# Altium schematic sheet Sheet1.SchDoc
size A4
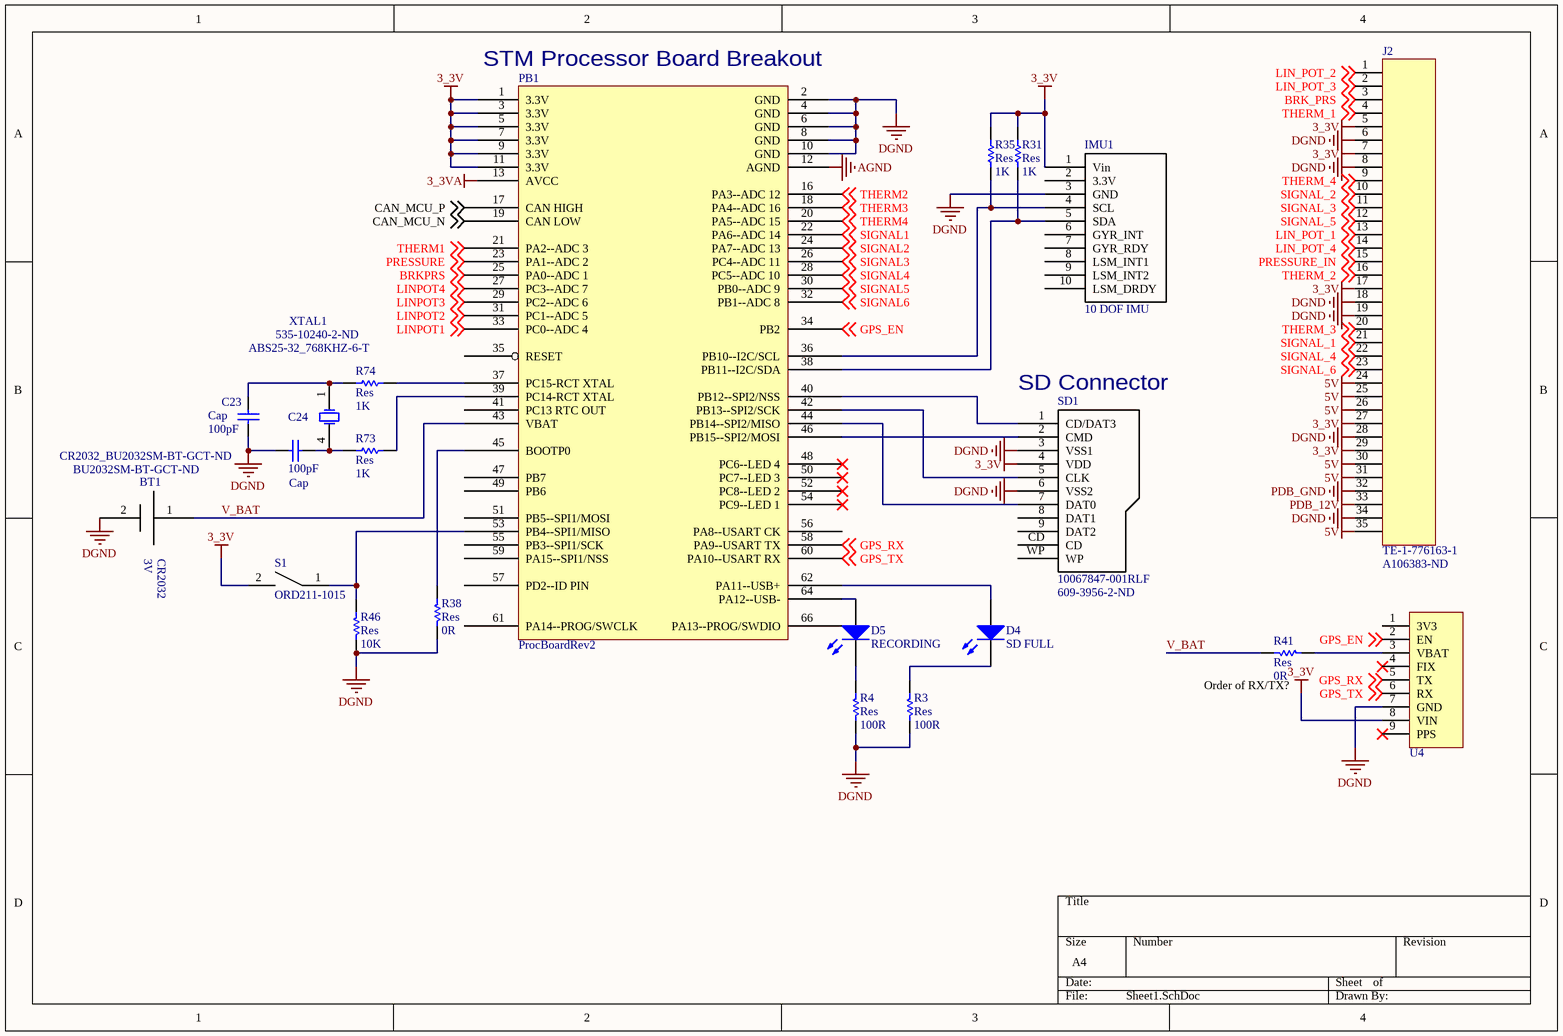
[diagram p0: Sheet1.SchDoc]

## Parts
BT1  CR2032_BU2032SM-BT-GCT-ND  [BU2032SM-BT-GCT-ND]
C23  Cap  value 100pF  [C0805]
C24  Cap  value 100pF  [C0805]
D4  SD FULL  [OVS5MABCR4]
D5  RECORDING  [OVS5MGBCR4]
IMU1  10 DOF IMU  [Adafruit_10DOF_IMU]
J2  TE-1-776163-1  Supplier Part Number 1: A106383-ND  [TE-1-776163-1]
PB1  ProcBoardRev2  [PROC_BOARD]
R3  Res  value 100R  [3216[1206]]
R4  Res  value 100R  [3216[1206]]
R31  Res  value 1K  [2012[0805]]
R35  Res  value 1K  [2012[0805]]
R38  Res  value 0R  [3216[1206]]  (no BOM)
R41  Res  value 0R  [3216[1206]]  (no BOM)
R46  Res  value 10K  [3216[1206]]
R73  Res  value 1K  [2012[0805]]
R74  Res  value 1K  [2012[0805]]
S1  ORD211-1015  [ORD211-1015]
SD1  10067847-001RLF  Supplier Part Number 1: 609-3956-2-ND  [10067847-001RLF]
U4  MTK3339 MODULE  [MTK3339 MODULE]  (value not drawn)
XTAL1  ABS25-32_768KHZ-6-T  Supplier Part Number 1: 535-10240-2-ND  [ABS25-32_768KHZ-6-T]

## Nets
3_3V: IMU1.1(Vin) J2.5 J2.7 J2.17 J2.27 J2.29 PB1.1(3.3V) PB1.3(3.3V) PB1.5(3.3V) PB1.7(3.3V) PB1.9(3.3V) PB1.11(3.3V) R31.1 R35.1 S1.2 SD1.4(VDD) U4.8(VIN)
3_3VA: PB1.13(AVCC)
5V: J2.24 J2.25 J2.26 J2.30 J2.31 J2.35
AGND: PB1.12(AGND)
DGND: BT1.2 C23.1 C24.2 IMU1.3(GND) J2.6 J2.8 J2.18 J2.19 J2.28 J2.34 PB1.2(GND) PB1.4(GND) PB1.6(GND) PB1.8(GND) PB1.10(GND) R3.1 R4.1 R38.1 R46.1 SD1.3(VSS1) SD1.6(VSS2) U4.7(GND)
PDB_12V: J2.33
PDB_GND: J2.32
BRK_PRS: J2.3 ; off-sheet BRK_PRS
BRKPRS: PB1.25(PA0--ADC_1) ; off-sheet BRKPRS
CAN_MCU_N: PB1.19(CAN_LOW) ; off-sheet CAN_MCU_N
CAN_MCU_P: PB1.17(CAN_HIGH) ; off-sheet CAN_MCU_P
GPS_EN: PB1.34(PB2) U4.2(EN) ; off-sheet GPS_EN
GPS_RX: PB1.58(PA9--USART_TX) U4.5(TX) ; off-sheet GPS_RX
GPS_TX: PB1.60(PA10--USART_RX) U4.6(RX) ; off-sheet GPS_TX
LIN_POT_1: J2.13 ; off-sheet LIN_POT_1
LIN_POT_2: J2.1 ; off-sheet LIN_POT_2
LIN_POT_3: J2.2 ; off-sheet LIN_POT_3
LIN_POT_4: J2.14 ; off-sheet LIN_POT_4
LINPOT1: PB1.33(PC0--ADC_4) ; off-sheet LINPOT1
LINPOT2: PB1.31(PC1--ADC_5) ; off-sheet LINPOT2
LINPOT3: PB1.29(PC2--ADC_6) ; off-sheet LINPOT3
LINPOT4: PB1.27(PC3--ADC_7) ; off-sheet LINPOT4
PRESSURE: PB1.23(PA1--ADC_2) ; off-sheet PRESSURE
PRESSURE_IN: J2.15 ; off-sheet PRESSURE_IN
SIGNAL1: PB1.22(PA6--ADC_14) ; off-sheet SIGNAL1
SIGNAL2: PB1.24(PA7--ADC_13) ; off-sheet SIGNAL2
SIGNAL3: PB1.26(PC4--ADC_11) ; off-sheet SIGNAL3
SIGNAL4: PB1.28(PC5--ADC_10) ; off-sheet SIGNAL4
SIGNAL5: PB1.30(PB0--ADC_9) ; off-sheet SIGNAL5
SIGNAL6: PB1.32(PB1--ADC_8) ; off-sheet SIGNAL6
SIGNAL_1: J2.21 ; off-sheet SIGNAL_1
SIGNAL_2: J2.10 ; off-sheet SIGNAL_2
SIGNAL_3: J2.11 ; off-sheet SIGNAL_3
SIGNAL_4: J2.22 ; off-sheet SIGNAL_4
SIGNAL_5: J2.12 ; off-sheet SIGNAL_5
SIGNAL_6: J2.23 ; off-sheet SIGNAL_6
THERM1: PB1.21(PA2--ADC_3) ; off-sheet THERM1
THERM2: PB1.16(PA3--ADC_12) ; off-sheet THERM2
THERM3: PB1.18(PA4--ADC_16) ; off-sheet THERM3
THERM4: PB1.20(PA5--ADC_15) ; off-sheet THERM4
THERM_1: J2.4 ; off-sheet THERM_1
THERM_2: J2.16 ; off-sheet THERM_2
THERM_3: J2.20 ; off-sheet THERM_3
THERM_4: J2.9 ; off-sheet THERM_4
V_BAT: BT1.1 PB1.43(VBAT) R41.2
NetC23_2: C23.2 R74.2 XTAL1.1(OSC1)
NetC24_1: C24.1 R73.2 XTAL1.4(OSC4)
NetD4_1: D4.1(A) PB1.62(PA11--USB+)
NetD4_2: D4.2(K) R3.2
NetD5_1: D5.1(A) PB1.64(PA12--USB-)
NetD5_2: D5.2(K) R4.2
NetIMU1_4: IMU1.4(SCL) PB1.36(PB10--I2C/SCL) R35.2
NetIMU1_5: IMU1.5(SDA) PB1.38(PB11--I2C/SDA) R31.2
NetPB1_37: PB1.37(PC15-RCT_XTAL) R74.1
NetPB1_39: PB1.39(PC14-RCT_XTAL) R73.1
NetPB1_40: PB1.40(PB12--SPI2/NSS) SD1.1(CD/DAT3)
NetPB1_42: PB1.42(PB13--SPI2/SCK) SD1.5(CLK)
NetPB1_44: PB1.44(PB14--SPI2/MISO) SD1.7(DAT0)
NetPB1_45: PB1.45(BOOTP0) R38.2
NetPB1_46: PB1.46(PB15--SPI2/MOSI) SD1.2(CMD)
NetPB1_53: PB1.53(PB4--SPI1/MISO) R46.2 S1.1
NetR41_1: R41.1 U4.3(VBAT)

Not connected (* = marked no-connect by the designer): IMU1 2(3.3V) 6(GYR_INT) 7(GYR_RDY) 8(LSM_INT1) 9(LSM_INT2) 10(LSM_DRDY); PB1 14(NC) 15(NC) 35(RESET) 41(PC13_RTC_OUT) 47(PB7) 48(PC6--LED_4)* 49(PB6) 50(PC7--LED_3)* 51(PB5--SPI1/MOSI) 52(PC8--LED_2)* 54(PC9--LED_1)* 55(PB3--SPI1/SCK) 56(PA8--USART_CK) 57(PD2--ID_PIN) 59(PA15--SPI1/NSS) 61(PA14--PROG/SWCLK) 63(NC) 65(NC) 66(PA13--PROG/SWDIO) 67; SD1 8(DAT1) 9(DAT2) CD WP; U4 1(3V3) 4(FIX)* 9(PPS)*

## Notes on the sheet
- (near PB1) STM Processor Board Breakout
- (near SD1) SD Connector
- (near R41) Order of RX/TX?
- (in symbol CR2032_BU2032SM-BT-GCT-ND) 3V; CR2032

## Library data of the parts
BT1 = CR2032_BU2032SM-BT-GCT-ND: Coin Cell Battery Holder_BU2032SM-BT-GCT-ND; Supplier: Digikey; Supplier 1: Digi-Key; Supplier Part Number 1: BU2032SM-BT-GCT-ND; Supplier Pt Number: BU2032SM-BT-GCT-ND
C23 C24 = Cap: Capacitor; Published: 8-Jun-2000; LatestRevisionDate: 17-Jul-2002; LatestRevisionNote: Re-released for DXP Platform.; PackageReference: C1206; Publisher: Altium Limited
D4 = OVS5MABCR4: Typical AMBER LED; Published: 8-Jun-2000; LatestRevisionDate: 17-Jul-2002; LatestRevisionNote: Re-released for DXP Platform.; PackageDocument: Feb-2002; PackageReference: 3.2X1.6X1.1; Publisher: Altium Limited; Supplier 1: Digi-Key; Colour: AMBER; Supplier Part Number 1: 365-1543-1-ND
D5 = OVS5MGBCR4: Typical GREEN LED; Published: 8-Jun-2000; LatestRevisionDate: 17-Jul-2002; LatestRevisionNote: Re-released for DXP Platform.; PackageDocument: Feb-2002; PackageReference: 3.2X1.6X1.1; Publisher: Altium Limited; Supplier 1: Digi-Key; Colour: GREEN; Supplier Part Number 1: 365-1545-1-ND
IMU1 = Adafruit_10DOF_IMU
J2 = TE-1-776163-1: CONN HEADER 35POS R/A GOLD BLACK; Supplier 1: Digi-Key
PB1 = ProcBoardRev2: Processor board that carries the STM32F072RB
R3 R4 R31 R35 R38 R41 R46 R73 R74 = Res: Surface Mount Resistor; Published: 8-Jun-2000; LatestRevisionDate: 17-Jul-2002; LatestRevisionNote: Re-released for DXP Platform.; PackageReference: AXIAL-0.5; Publisher: Altium Limited
S1 = ORD211-1015: REED Switch; Manufacturer: Standex-Meder Electronics; Circuit: SPST-NO; Operate Range: 10 ~ 15AT; Current - Switching: 100mA (AC/DC); Voltage - Switching AC: 24V; Power - Rated: 1VA; Operate Time: 0.3ms; Release Time: 0.05ms; Capacitance: 0.20pF; Current - Carry: 300mA (AC/DC); Supplier 1: Digi-Key; Supplier Part Number 1: 374-1083-ND; RoHS: RoHS Compliant; Category: Switches; Stock 1: 4721; Pricing 1: 1=1.15, 10=1.007, 25=0.9664, 50=0.906, 100=0.8858, 250=0.7046, 500=0.64422, 1000=0.62409, 5000=0.56369 (CAD); Packaging: Bulk; Type: Glass Body; Release Range: -; Voltage - Switching DC: 24V; Mounting Type: Through Hole; Termination Style: Axial; Length - Overall: 1.406" (35.70mm); Size - Body: 0.079" Dia x 0.394" L (2.00mm x 10.00mm); Height Above Board: -; Operating Temperature: -; ComponentLink1URL: https://standexelectronics.com/wp-content/uploads/OKI_Reed_Switch_ORD211.pdf; ComponentLink1Description: https://standexelectronics.com/wp-content/uploads/OKI_Reed_Switch_ORD211.pdf; Manufacturer Part Number: ORD211-1015
SD1 = 10067847-001RLF: SD Card Connector; Supplier 1: Digi-Key
U4 = MTK3339 MODULE: GPS Module Breakout
XTAL1 = ABS25-32_768KHZ-6-T: 32.768KHz Crystal Oscillator; Supplier 1: Digi-Key